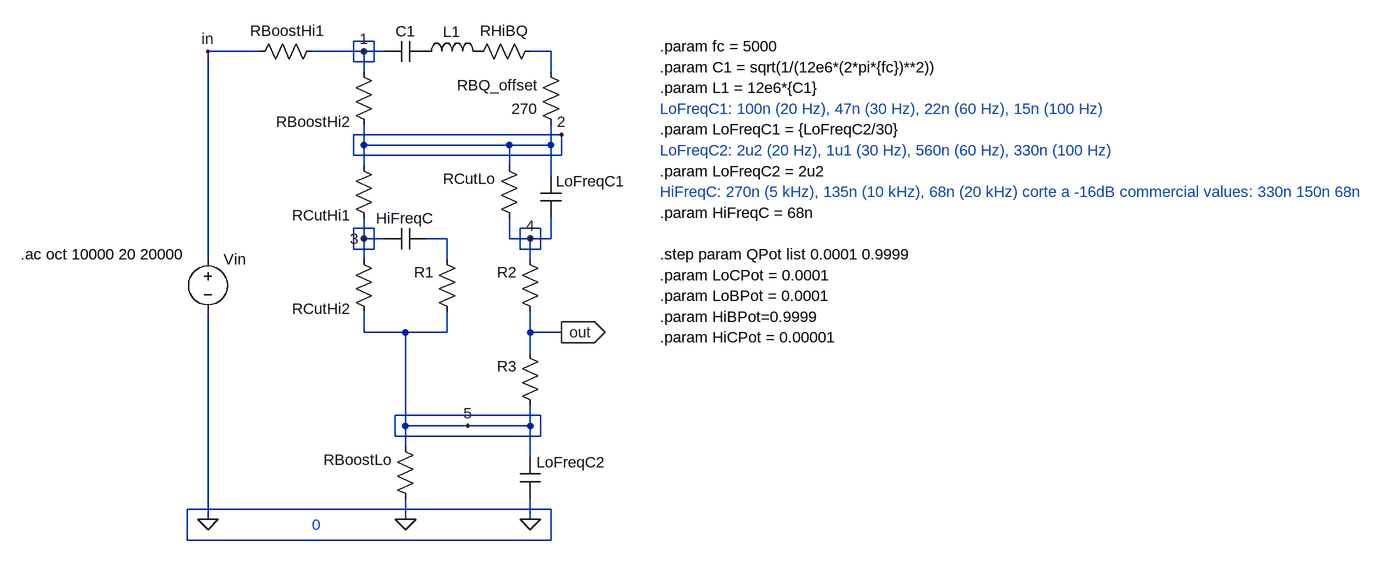
[diagram p0: schematic myEQP1A.asc]
myEQP1A.asc, the LTspice schematic file:
Version 4
SHEET 1 1176 1412
WIRE -448 -208 -480 -208
WIRE -624 -192 -704 -192
WIRE -464 -192 -544 -192
WIRE -432 -192 -464 -192
WIRE -176 -192 -208 -192
WIRE -480 -176 -480 -208
WIRE -448 -176 -448 -208
WIRE -448 -176 -480 -176
WIRE -464 -160 -464 -192
WIRE -176 -160 -176 -192
WIRE -160 -64 -480 -64
WIRE -464 -48 -464 -80
WIRE -240 -48 -464 -48
WIRE -176 -48 -176 -80
WIRE -176 -48 -240 -48
WIRE -480 -32 -480 -64
WIRE -160 -32 -160 -64
WIRE -160 -32 -480 -32
WIRE -464 -16 -464 -48
WIRE -240 -16 -240 -48
WIRE -176 0 -176 -48
WIRE -448 80 -480 80
WIRE -192 80 -224 80
WIRE -464 96 -464 64
WIRE -432 96 -464 96
WIRE -336 96 -368 96
WIRE -240 96 -240 64
WIRE -208 96 -240 96
WIRE -176 96 -176 64
WIRE -176 96 -208 96
WIRE -480 112 -480 80
WIRE -448 112 -448 80
WIRE -448 112 -480 112
WIRE -224 112 -224 80
WIRE -192 112 -192 80
WIRE -192 112 -224 112
WIRE -704 128 -704 -192
WIRE -464 128 -464 96
WIRE -336 128 -336 96
WIRE -208 128 -208 96
WIRE -464 240 -464 208
WIRE -400 240 -464 240
WIRE -336 240 -336 208
WIRE -336 240 -400 240
WIRE -208 240 -208 208
WIRE -160 240 -208 240
WIRE -208 272 -208 240
WIRE -192 368 -416 368
WIRE -400 384 -400 240
WIRE -304 384 -400 384
WIRE -208 384 -208 352
WIRE -208 384 -304 384
WIRE -416 400 -416 368
WIRE -192 400 -192 368
WIRE -192 400 -416 400
WIRE -400 416 -400 384
WIRE -208 432 -208 384
WIRE -176 512 -736 512
WIRE -704 528 -704 208
WIRE -400 528 -400 496
WIRE -208 528 -208 496
WIRE -736 560 -736 512
WIRE -176 560 -176 512
WIRE -176 560 -736 560
FLAG -704 528 0
FLAG -400 528 0
FLAG -208 528 0
FLAG -160 240 out
IOPIN -160 240 Out
FLAG -704 -192 in
FLAG -464 -192 1
FLAG -160 -64 2
FLAG -464 96 3
FLAG -208 96 4
FLAG -304 384 5
SYMBOL cap -432 -176 R270
WINDOW 0 47 17 VRight 2
WINDOW 3 0 32 Invisible 2
SYMATTR InstName C1
SYMATTR Value {C1}
SYMBOL ind -384 -176 R270
WINDOW 0 46 42 VRight 2
WINDOW 3 1 57 Invisible 2
SYMATTR InstName L1
SYMATTR Value {L1}
SYMBOL cap -192 0 R0
WINDOW 3 24 56 Invisible 2
SYMATTR Value {LoFreqC1}
SYMATTR InstName LoFreqC1
SYMBOL voltage -704 112 R0
WINDOW 3 24 96 Invisible 2
SYMATTR Value ""
SYMATTR Value2 AC 1
SYMATTR InstName Vin
SYMBOL res -528 -208 R90
WINDOW 0 0 54 VBottom 2
WINDOW 3 -10 54 Invisible 2
SYMATTR InstName RBoostHi1
SYMATTR Value {(1-HiBPot)*10k}
SYMBOL res -448 -64 R180
WINDOW 0 36 20 Left 2
WINDOW 3 36 48 Invisible 2
SYMATTR InstName RBoostHi2
SYMATTR Value {HiBPot*10k}
SYMBOL res -192 -208 R90
WINDOW 0 0 56 VBottom 2
WINDOW 3 32 56 Invisible 2
SYMATTR InstName RHiBQ
SYMATTR Value {QPot*2k4}
SYMBOL res -224 80 R180
WINDOW 0 36 76 Left 2
WINDOW 3 36 40 Invisible 2
SYMATTR InstName RCutLo
SYMATTR Value {LoCPot*110k}
SYMBOL res -448 80 R180
WINDOW 0 36 20 Left 2
WINDOW 3 36 48 Invisible 2
SYMATTR InstName RCutHi1
SYMATTR Value {(1-HiCPot)*1k}
SYMBOL cap -368 80 R90
WINDOW 0 0 32 VBottom 2
WINDOW 3 32 32 Invisible 2
SYMATTR InstName HiFreqC
SYMATTR Value {HiFreqC}
SYMBOL res -320 224 R180
WINDOW 0 36 76 Left 2
WINDOW 3 36 40 Invisible 2
SYMATTR InstName R1
SYMATTR Value 91
SYMBOL res -448 224 R180
WINDOW 0 36 20 Left 2
WINDOW 3 36 48 Invisible 2
SYMATTR InstName RCutHi2
SYMATTR Value {HiCPot*1k}
SYMBOL res -192 224 R180
WINDOW 0 36 76 Left 2
WINDOW 3 36 40 Invisible 2
SYMATTR InstName R2
SYMATTR Value 1k
SYMBOL res -384 512 R180
WINDOW 0 36 76 Left 2
WINDOW 3 36 40 Invisible 2
SYMATTR InstName RBoostLo
SYMATTR Value {LoBPot*9k1}
SYMBOL cap -224 432 R0
WINDOW 0 26 8 Left 2
WINDOW 3 24 56 Invisible 2
SYMATTR InstName LoFreqC2
SYMATTR Value {LoFreqC2}
SYMBOL res -192 368 R180
WINDOW 0 36 76 Left 2
WINDOW 3 36 40 Invisible 2
SYMATTR InstName R3
SYMATTR Value 10k
SYMBOL res -160 -64 R180
WINDOW 0 36 76 Left 2
WINDOW 3 36 40 Left 2
SYMATTR InstName RBQ_offset
SYMATTR Value 270
TEXT -8 -104 Left 2 ;LoFreqC1: 100n (20 Hz), 47n (30 Hz), 22n (60 Hz), 15n (100 Hz)
TEXT -544 536 Left 2 ;0
TEXT -8 -72 Left 2 !.param LoFreqC1 = {LoFreqC2/30}
TEXT -8 120 Left 2 !.step param QPot list 0.0001 0.9999
TEXT -8 -8 Left 2 !.param LoFreqC2 = 2u2
TEXT -8 152 Left 2 !.param LoCPot = 0.0001
TEXT -8 216 Left 2 !.param HiBPot=0.9999
TEXT -8 248 Left 2 !.param HiCPot = 0.00001
TEXT -992 120 Left 2 !.ac oct 10000 20 20000
TEXT -8 184 Left 2 !.param LoBPot = 0.0001
TEXT -8 -200 Left 2 !.param fc = 5000
TEXT -8 -168 Left 2 !.param C1 = sqrt(1/(12e6*(2*pi*{fc})**2))
TEXT -8 -136 Left 2 !.param L1 = 12e6*{C1}
TEXT -8 56 Left 2 !.param HiFreqC = 68n
TEXT -8 -40 Left 2 ;LoFreqC2: 2u2 (20 Hz), 1u1 (30 Hz), 560n (60 Hz), 330n (100 Hz)
TEXT -8 24 Left 2 ;HiFreqC: 270n (5 kHz), 135n (10 kHz), 68n (20 kHz) corte a -16dB commercial values: 330n 150n 68n

The netlist it stands for:
* myEQP1A.asc
C1 1 P001 {C1}
L1 P001 P002 {L1}
C§LoFreqC1 N003 4 {LoFreqC1}
Vin in 0 AC 1
RBoostHi1 1 in {(1-HiBPot)*10k}
RBoostHi2 N003 1 {HiBPot*10k}
RHiBQ N002 P002 {QPot*2k4}
RCutLo 4 N003 {LoCPot*110k}
RCutHi1 3 N003 {(1-HiCPot)*1k}
C§HiFreqC N006 3 {HiFreqC}
R1 5 N006 91
RCutHi2 5 3 {HiCPot*1k}
R2 out 4 1k
RBoostLo 0 5 {LoBPot*9k1}
C§LoFreqC2 5 0 {LoFreqC2}
R3 5 out 10k
RBQ_offset N003 N002 270
* LoFreqC1: 100n (20 Hz), 47n (30 Hz), 22n (60 Hz), 15n (100 Hz)
* 0
.param LoFreqC1 = {LoFreqC2/30}
.step param QPot list 0.0001 0.9999
.param LoFreqC2 = 2u2
.param LoCPot = 0.0001
.param HiBPot=0.9999
.param HiCPot = 0.00001
.ac oct 10000 20 20000
.param LoBPot = 0.0001
.param fc = 5000
.param C1 = sqrt(1/(12e6*(2*pi*{fc})**2))
.param L1 = 12e6*{C1}
.param HiFreqC = 68n
* LoFreqC2: 2u2 (20 Hz), 1u1 (30 Hz), 560n (60 Hz), 330n (100 Hz)
* HiFreqC: 270n (5 kHz), 135n (10 kHz), 68n (20 kHz) corte a -16dB commercial values: 330n 150n 68n
.backanno
.end